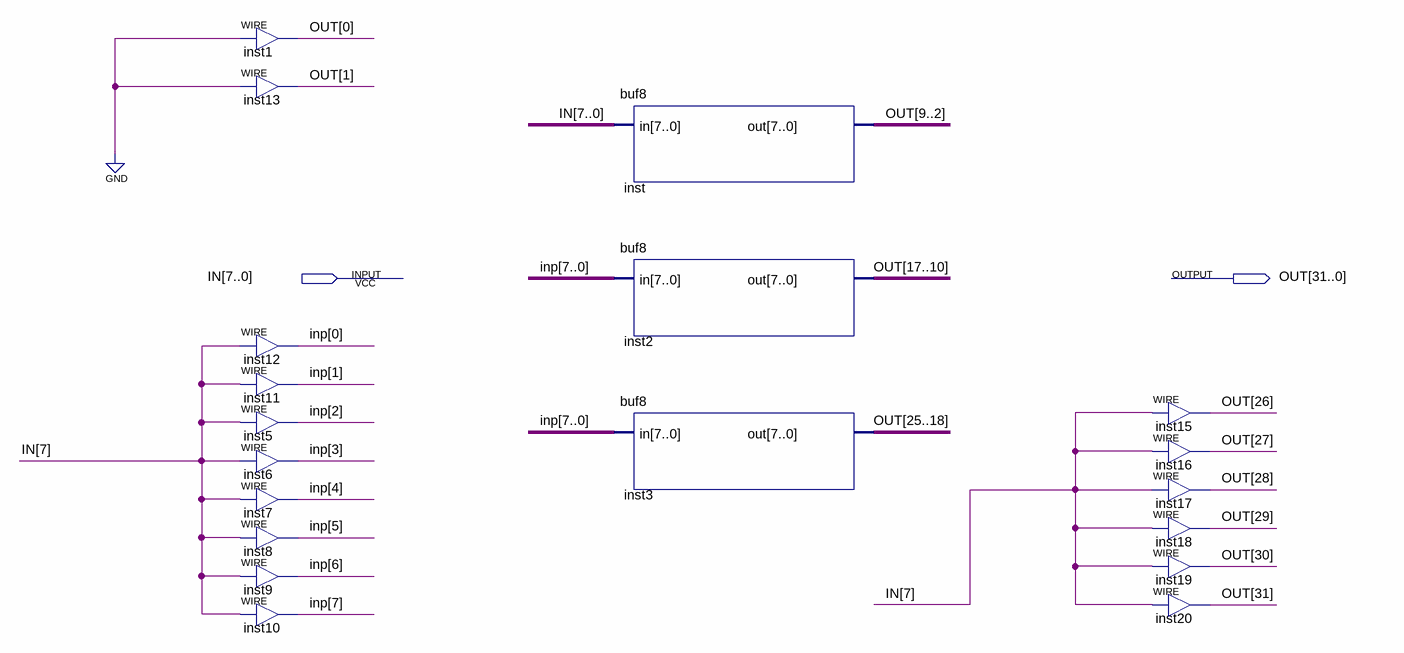
[diagram p0: schematic sheet]
// Quartus schematic shifter8T32signed2Address.bdf as structural Verilog: 19 symbols, 2 pins
module shifter8T32signed2Address (
  input  [7:0] IN,
  output [31:0] OUT
);

  wire [7:0] inp;

  assign OUT[0] = 1'b0;  // WIRE inst1
  assign OUT[1] = 1'b0;  // WIRE inst13
  assign inp[0] = IN[7];  // WIRE inst12
  assign inp[1] = IN[7];  // WIRE inst11
  assign inp[2] = IN[7];  // WIRE inst5
  assign inp[3] = IN[7];  // WIRE inst6
  assign inp[4] = IN[7];  // WIRE inst7
  assign inp[5] = IN[7];  // WIRE inst8
  assign inp[6] = IN[7];  // WIRE inst9
  assign inp[7] = IN[7];  // WIRE inst10
  buf8 inst (.in(IN), .out(OUT[9:2]));
  buf8 inst2 (.in(inp), .out(OUT[17:10]));
  buf8 inst3 (.in(inp), .out(OUT[25:18]));
  assign OUT[26] = IN[7];  // WIRE inst15
  assign OUT[27] = IN[7];  // WIRE inst16
  assign OUT[28] = IN[7];  // WIRE inst17
  assign OUT[29] = IN[7];  // WIRE inst18
  assign OUT[30] = IN[7];  // WIRE inst19
  assign OUT[31] = IN[7];  // WIRE inst20
endmodule
